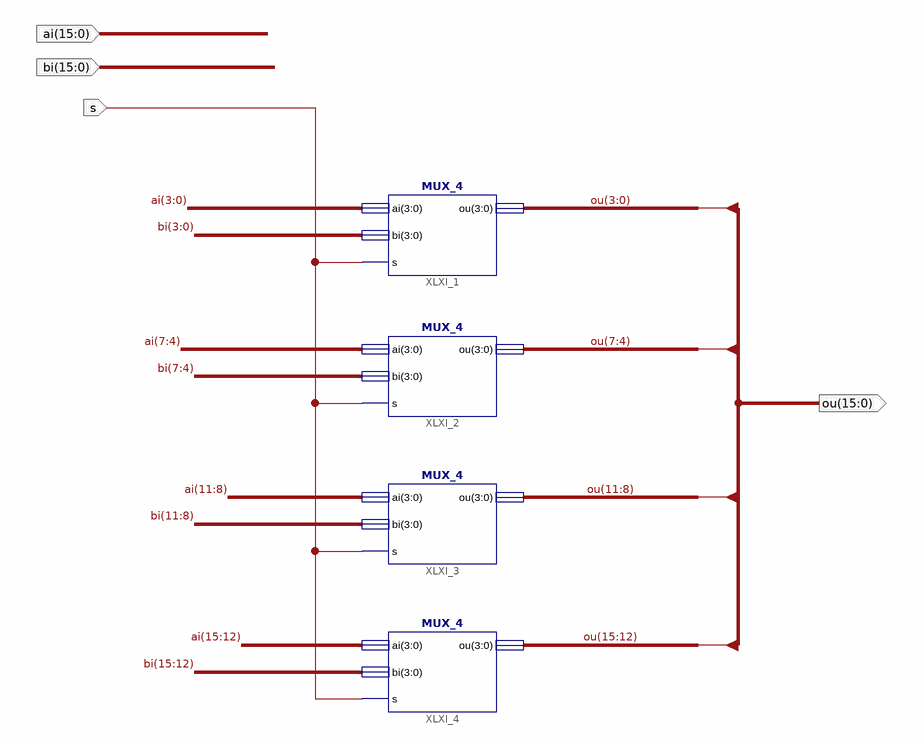
[diagram p0: schematic sheet 1]
// Xilinx ISE schematic MUX_16.sch (kintex7) as structural Verilog: 4 symbols, 4 ports
module MUX_16 (
  input  [15:0] ai,
  input  [15:0] bi,
  input  s,
  output [15:0] ou
);

  MUX_4 XLXI_1 (.ai(ai[3:0]), .bi(bi[3:0]), .s(s), .ou(ou[3:0]));
  MUX_4 XLXI_2 (.ai(ai[7:4]), .bi(bi[7:4]), .s(s), .ou(ou[7:4]));
  MUX_4 XLXI_3 (.ai(ai[11:8]), .bi(bi[11:8]), .s(s), .ou(ou[11:8]));
  MUX_4 XLXI_4 (.ai(ai[15:12]), .bi(bi[15:12]), .s(s), .ou(ou[15:12]));
endmodule
